# EAGLE design yolo (EAGLE 9.5.0)
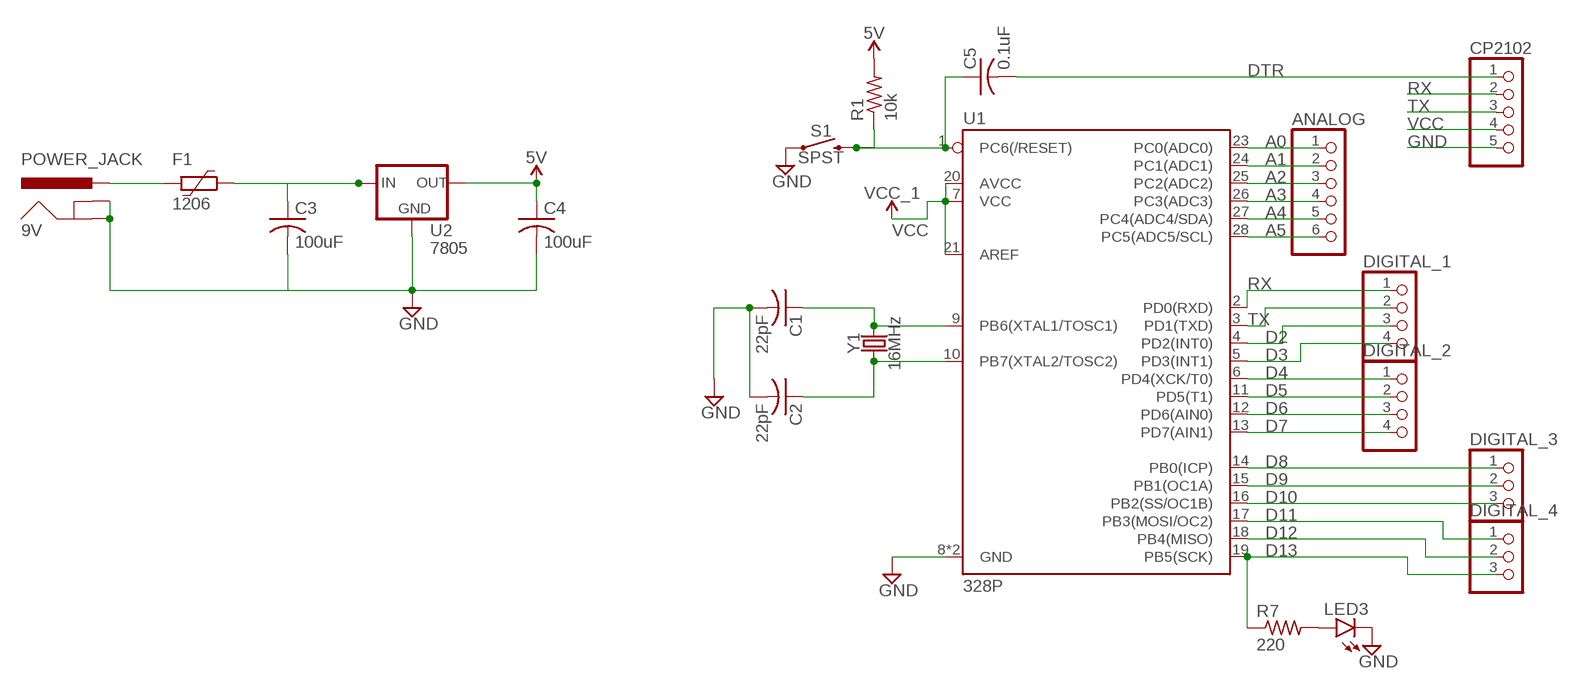
[diagram p0: schematic, sheet 1]

## Parts
9V  POWER_JACK  [POWER_JACK_PTH]
ANALOG  PINHD-1X6  [1X06]
C1  22pF  C-US025-025X050  [C025-025X050]
C2  22pF  C-US025-025X050  [C025-025X050]
C3  100uF  C-US025-025X050  [C025-025X050]
C4  100uF  C-US025-025X050  [C025-025X050]
C5  0.1uF  C-US025-025X050  [C025-025X050]
CP2102  PINHD-1X5  [1X05]
DIGITAL_1  PINHD-1X4  [1X04]
DIGITAL_2  PINHD-1X4  [1X04]
DIGITAL_3  PINHD-1X3  [1X03]
DIGITAL_4  PINHD-1X3  [1X03]
F1  1206  1206L175SL  [1206L]
LED3  LED5MM  [LED5MM]
R1  10k  R-US_0204/7  [0204/7]
R7  220  R-US_0204/7  [0204/7]
S1  SPST  MOMENTARY-SWITCH-SPST-PTH-6.0MM  [TACTILE_SWITCH_PTH_6.0MM]
U1  328P  ATMEGA328P_PDIP  [DIP28]
U2  7805  R-78E5.0-1.0  [DC-DC_CONVERTER_78XX]
Y1  16MHz  CRYSTAL-16MHZPTH-HC49US  [HC49US]

## Nets
A0: ANALOG.1 U1.23(PC0(ADC0))
A1: ANALOG.2 U1.24(PC1(ADC1))
A2: ANALOG.3 U1.25(PC2(ADC2))
A3: ANALOG.4 U1.26(PC3(ADC3))
A4: ANALOG.5 U1.27(PC4(ADC4/SDA))
A5: ANALOG.6 U1.28(PC5(ADC5/SCL))
D2: DIGITAL_1.3 U1.4(PD2(INT0))
D3: DIGITAL_1.4 U1.5(PD3(INT1))
D4: DIGITAL_2.1 U1.6(PD4(XCK/T0))
D5: DIGITAL_2.2 U1.11(PD5(T1))
D6: DIGITAL_2.3 U1.12(PD6(AIN0))
D7: DIGITAL_2.4 U1.13(PD7(AIN1))
D8: DIGITAL_3.1 U1.14(PB0(ICP))
D9: DIGITAL_3.2 U1.15(PB1(OC1A))
D10: DIGITAL_3.3 U1.16(PB2(SS/OC1B))
D11: DIGITAL_4.1 U1.17(PB3(MOSI/OC2))
D12: DIGITAL_4.2 U1.18(PB4(MISO))
D13: DIGITAL_4.3 R7.1 U1.19(PB5(SCK))
DTR: C5.2 CP2102.1
GND: 9V.GND 9V.GNDBREAK C1.2 C2.2 C3.2 C4.2 CP2102.5 LED3.K(C) S1.1 U1.8(GND) U1.22(GND) U2.GND
N$2: 9V.PWR F1.2
N$3: C3.1 F1.1 U2.VIN(IN)
N$4: C1.1 U1.9(PB6(XTAL1/TOSC1)) Y1.2
N$6: C2.1 U1.10(PB7(XTAL2/TOSC2)) Y1.1
N$8: LED3.A R7.2
RST: C5.1 R1.1 S1.3 U1.1(PC6(/RESET))
RX: CP2102.2 DIGITAL_1.1 U1.2(PD0(RXD))
TX: CP2102.3 DIGITAL_1.2 U1.3(PD1(TXD))
VCC: CP2102.4 U1.7(VCC) U1.20(AVCC) U1.21(AREF) ; supply symbol labelled VCC_1
VCC_1: C4.1 R1.2 U2.VOUT(OUT) ; supply symbol labelled 5V

## Library data of the parts
9V = SparkFun-Connectors:POWER_JACK: Power Jack Connector This is the standard 5.5mm barrel jack for power. The PTH is the most common, proven, reliable, footprint. The Slot footprint only works if the mill layer is transmitted to the PCB fab house so be warned. Here are the connectors we sell at SparkFun: DC Barrel Power Jack/Connector <https://www.sparkfun.com/products/119> (PRT-00119) DC Barrel Power Jack/Connector (SMD) <https://www.sparkfun.com/products/12748> (PRT-12748) DC Barrel Jack Adapter - Breadboard Compatible <https://www.sparkfun.com/products/10811> (PRT-10811) It is used on this SparkFun product (and many, many others): SparkFun RedBoard - Programmed with Arduino <https://www.sparkfun.com/products/12757> (DEV-12757) Also, if you need a mating power supply or connector, please check these out: Wall Adapter Power Supply - 9VDC 650mA <https://www.sparkfun.com/products/298> (TOL-00298) DC Barrel Jack Adapter - Male <https://www.sparkfun.com/products/10287> (PRT-10287); PROD_ID: CONN-08197
ANALOG = pinhead:PINHD-1X6: PIN HEADER
C1-C5 = rcl:C-US: CAPACITOR, American symbol; SPICEPREFIX: C
CP2102 = pinhead:PINHD-1X5: PIN HEADER
DIGITAL_1 DIGITAL_2 = pinhead:PINHD-1X4: PIN HEADER
DIGITAL_3 DIGITAL_4 = pinhead:PINHD-1X3: PIN HEADER
F1 = polyfuse-smd_10:?: Polyfuse Resettable PTC Source: http://www.littelfuse.com/products/resettable-ptcs.aspx; MF: Littelfuse; MPN: 1206L175SL; OC_FARNELL: unknown; OC_NEWARK: 69W6447
LED3 = led:LED: LED OSRAM: - CHIPLED LG R971, LG N971, LY N971, LG Q971, LY Q971, LO R971, LY R971 LH N974, LH R974 LS Q976, LO Q976, LY Q976 LO Q996 - Hyper CHIPLED LW Q18S LB Q993, LB Q99A, LB R99A - SideLED LS A670, LO A670, LY A670, LG A670, LP A670 LB A673, LV A673, LT A673, LW A673 LH A674 LY A675 LS A676, LA A676, LO A676, LY A676, LW A676 LS A679, LY A679, LG A679 - Hyper Micro SIDELED® LS Y876, LA Y876, LO Y876, LY Y876 LT Y87S - SmartLED LW L88C, LW L88S LB L89C, LB L89S, LG L890 LS L89K, LO L89K, LY L89K LS L896, LA L896, LO L896, LY L896 - TOPLED LS T670, LO T670, LY T670, LG T670, LP T670 LSG T670, LSP T670, LSY T670, LOP T670, LYG T670 LG T671, LOG T671, LSG T671 LB T673, LV T673, LT T673, LW T673 LH T674 LS T676, LA T676, LO T676, LY T676, LB T676, LH T676, LSB T676, LW T676 LB T67C, LV T67C, LT T67C, LS T67K, LO T67K, LY T67K, LW E67C LS E67B, LA E67B, LO E67B, LY E67B, LB E67C, LV E67C, LT E67C LW T67C LS T679, LY T679, LG T679 LS T770, LO T770, LY T770, LG T770, LP T770 LB T773, LV T773, LT T773, LW T773 LH T774 LS E675, LA E675, LY E675, LS T675 LS T776, LA T776, LO T776, LY T776, LB T776 LHGB T686 LT T68C, LB T68C - Hyper Mini TOPLED® LB M676 - Mini TOPLED Santana® LG M470 LS M47K, LO M47K, LY M47K Source: http://www.osram.convergy.de LUXEON: - LUMILED® LXK2-PW12-R00, LXK2-PW12-S00, LXK2-PW14-U00, LXK2-PW14-V00 LXK2-PM12-R00, LXK2-PM12-S00, LXK2-PM14-U00 LXK2-PE12-Q00, LXK2-PE12-R00, LXK2-PE12-S00, LXK2-PE14-T00, LXK2-PE14-U00 LXK2-PB12-K00, LXK2-PB12-L00, LXK2-PB12-M00, LXK2-PB14-N00, LXK2-PB14-P00, LXK2-PB14-Q00 LXK2-PR12-L00, LXK2-PR12-M00, LXK2-PR14-Q00, LXK2-PR14-R00 LXK2-PD12-Q00, LXK2-PD12-R00, LXK2-PD12-S00 LXK2-PH12-R00, LXK2-PH12-S00 LXK2-PL12-P00, LXK2-PL12-Q00, LXK2-PL12-R00 Source: www.luxeon.com KINGBRIGHT: KA-3528ASYC Source: www.kingbright.com
R1 R7 = rcl:R-US_: RESISTOR, American symbol; SPICEPREFIX: R
S1 = SparkFun-Switches:MOMENTARY-SWITCH-SPST: Momentary Switch (Pushbutton) - SPST Normally-open (NO) SPST momentary switches (buttons, pushbuttons). Variants PTH-12MM - 12mm square, through-hole Momentary Pushbutton Switch - 12mm Square <https://www.sparkfun.com/products/9190> (COM-09190) PTH-6.0MM, PTH-6.0MM-KIT - 6.0mm square, through-hole Mini Pushbutton Switch <https://www.sparkfun.com/products/97> (COM-00097) KIT package intended for soldering kit's - only one side of pads' copper is exposed. PTH-RIGHT-ANGLE-KIT - Right-angle, through-hole Right Angle Tactile Button <https://www.sparkfun.com/products/10791> - Used on SparkFun BigTime Watch Kit <https://www.sparkfun.com/products/11734> SMD-12MM - 12mm square, surface-mount Tactile Button - SMD (12mm) <https://www.sparkfun.com/products/12993> (COM-12993) Used on SparkFun PicoBoard <https://www.sparkfun.com/products/11888> SMD-4.5MM - 4.5mm Square Trackball Switch Used on SparkFun Blackberry Trackballer Breakout <https://www.sparkfun.com/products/13169> SMD-4.6MMX2.8MM - 4.60mm x 2.80mm, surface mount Used on SparkFun SAMD21 Mini Breakout <https://www.sparkfun.com/products/13664> SMD-5.2MM, SMD-5.2-REDUNDANT - 5.2mm square, surface-mount Mini Pushbutton Switch - SMD <https://www.sparkfun.com/products/8720> (COM-08720) Used on Arduino Pro Mini <https://www.sparkfun.com/products/11114> REDUNDANT package connects both switch circuits together SMD-6.0X3.5MM - 6.0 x 3.5mm, surface mount Momentary Reset Switch SMD <https://www.sparkfun.com/products/8229> (COM-08229) SMD-6.2MM-TALL - 6.2mm square, surface mount Tactile Button - SMD (6mm) <https://www.sparkfun.com/products/12992> Used on SparkFun Digital Sandbox <https://www.sparkfun.com/products/12651> SMD-RIGHT-ANGLE - Right-angle, surface mount Used on SparkFun Block for Intel® Edison - Arduino <https://www.sparkfun.com/products/13036>; PROD_ID: SWCH-08441; SF_SKU: COM-00097
U1 = SparkFun-IC-Microcontroller:ATMEGA328P_PDIP: Atmel 328P Through hole ATMEGA328P uC used in the Arduino 32kb flash, 1k EEPROM, 2k SRAM Datasheet <http://www.sparkfun.com/datasheets/Components/SMD/ATMega328.pdf> SparkFun Products Storefront component: AVR 28 Pin 20MHz 32K 6A/D - ATMega328P <https://www.sparkfun.com/products/9061> (COM-09061) SparkFun Simon Says - Through-Hole Soldering Kit <https://www.sparkfun.com/products/10547> (KIT-10547) SparkFun Learn to Solder - Simon Says <https://www.sparkfun.com/products/13708> (KIT-13708) SparkFun BigTime Watch Kit <https://www.sparkfun.com/products/11734> (KIT-11734) SparkFun ClockIt <https://www.sparkfun.com/products/10930> (KIT-10930) SparkFun Serial Enabled LCD Kit <https://www.sparkfun.com/products/10097> (LCD-10097) SparkFun Simon Tilts - Through Hole Soldering Kit <https://www.sparkfun.com/products/12634> (KIT-12634) SparkFun Frequency Counter Kit <https://www.sparkfun.com/products/10140> (KIT-10140) FabFM Radio Kit <https://www.sparkfun.com/products/11043> (KIT-11043) SparkFun Binary Blaster Kit <https://www.sparkfun.com/products/12037> (KIT-12037) SparkFun Metro-Gnome <https://www.sparkfun.com/products/9236> (KIT-09236) ATmega328 with Arduino Optiboot (Uno) <https://www.sparkfun.com/products/10524> (DEV-10524); PROD_ID: IC-09136
U2 = SparkFun-IC-Power:R-78E5.0-1.0: Recom Power 5V 1A DC/DC Converter The Recom R-78E5.0-X.X is a compact DC/DC converter module that is a pin for pin drop-in replacement for the LM7805 linear voltage regulator. Specifications: Input Range: 7-28V Output Voltage: 5V Output Current: 1A Max Efficiency: 91% Datasheet <https://www.recom-power.com/pdf/Innoline/R-78Exx-1.0.pdf>; PROD_ID: COM-13655
Y1 = SparkFun-Clocks:CRYSTAL-16MHZ: 16MHz Crystal Digikey Example <http://www.digikey.com/product-search/en?keywords=535-9122-1-ND> Frequency: 16MHz Frequency Stability: ±50ppm Frequency Tolerance: ±20ppm Load Capacitance: 18pF SparkFun Products: Pro Micro -5V/16MHz <https://www.sparkfun.com/products/12640> SparkFun Serial Enabled LCD Kit <https://www.sparkfun.com/products/10097>; PROD_ID: XTAL-08181; SF_ID: COM-00536

## Board
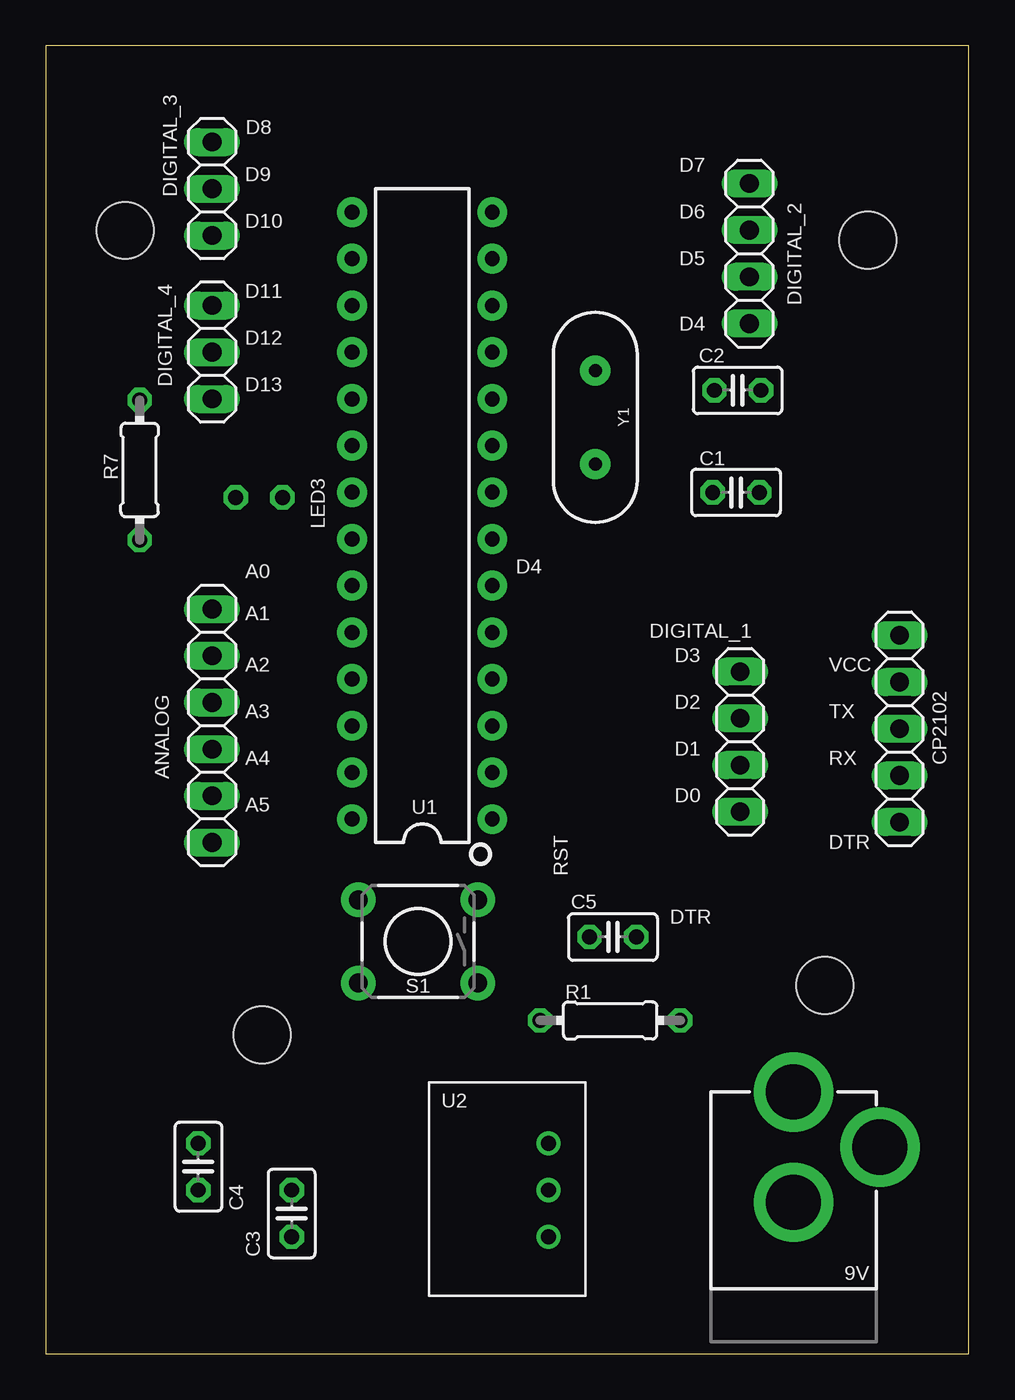
[diagram p1: board, top side]
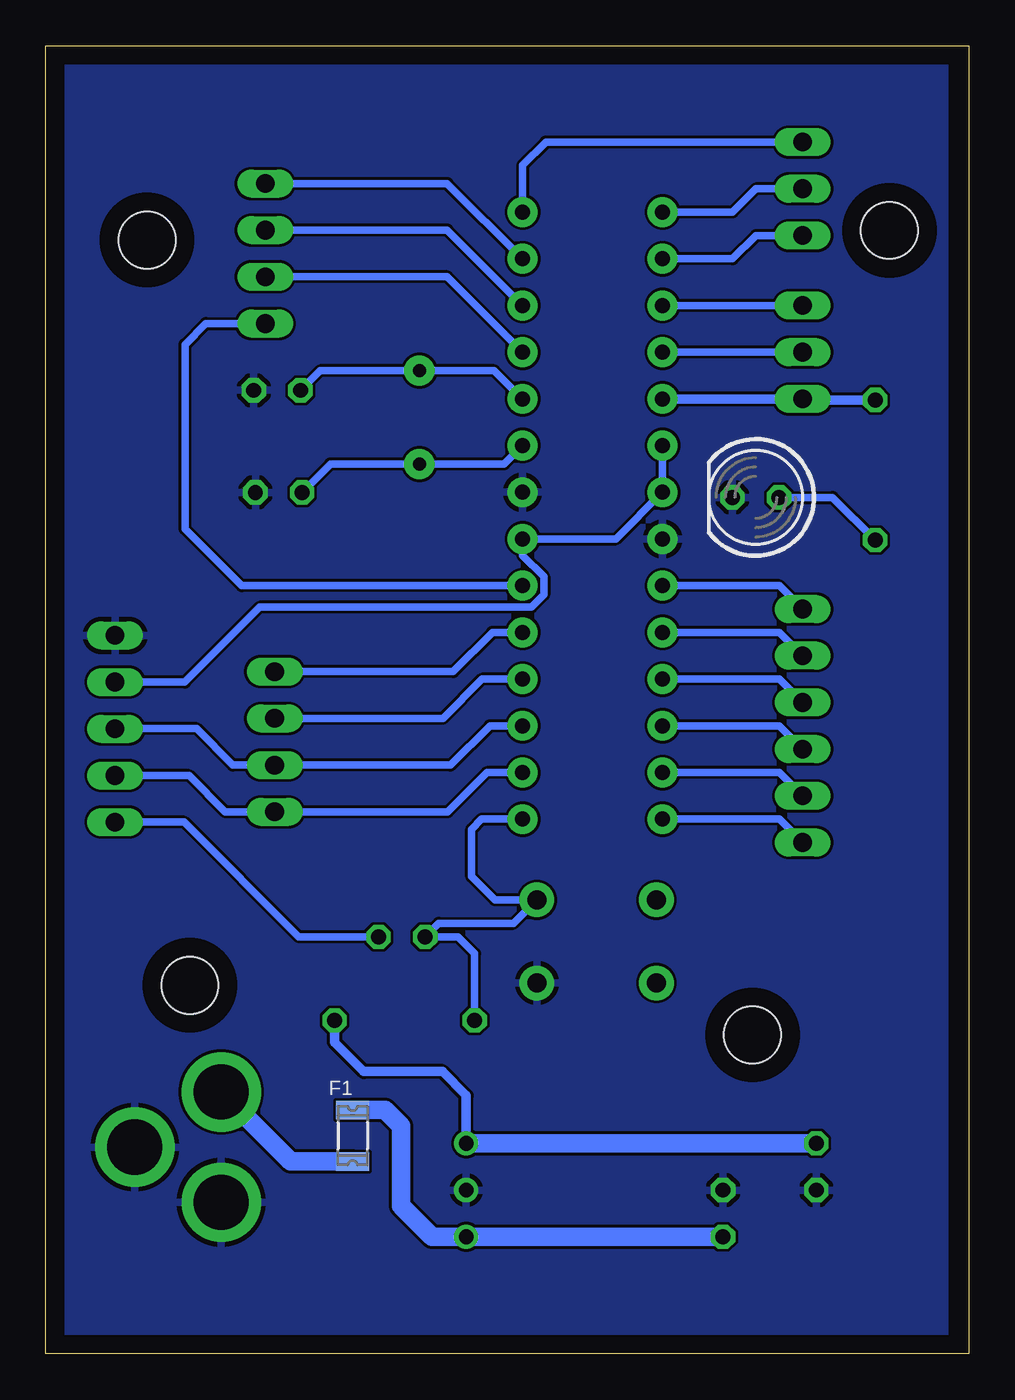
[diagram p2: board, bottom side, seen from below]

Size 50.2 x 71.12 mm. Coordinates in mm from the lower left corner, seen from the top.
Outline: 0,0 50.2,0 50.2,71.12 0,71.12 0,0
Copper layers (1*16): Top 0.035mm / dielectric 1.5mm / Bottom 0.035mm
Design rules "default": minimum track width 6mil, minimum drill 0.35mm, track to track 6mil, track to pad 6mil, pad to pad 6mil, via to via 6mil, smd to smd 6mil, copper to edge 40mil, drill to drill 6mil, minimum pad ring 10mil, minimum via ring 8mil, stop-mask expansion 4mil, vias tented up to drill 0mil, thermal gap 10mil
Holes 3.1 mm at 42.37,20.03 44.7,60.57 4.31,61.09 11.77,17.33

### Footprints (pad centres in the part's own frame; a part is rotated, then mirrored left to right if it is on the bottom)
POWER_JACK_PTH = drill 2.997 pad 4.318: GND 0,7.7; GNDBREAK 4.7,10.7; PWR 0,13.7
1X06 = drill 1.016 long: 1 -6.35,0; 2 -3.81,0; 3 -1.27,0; 4 1.27,0; 5 3.81,0; 6 6.35,0
C025-025X050 = drill 0.813 octagon: 1 -1.27,0; 2 1.27,0
1X05 = drill 1.016 long: 1 -5.08,0; 2 -2.54,0; 3 0,0; 4 2.54,0; 5 5.08,0
1X04 = drill 1.016 long: 1 -3.81,0; 2 -1.27,0; 3 1.27,0; 4 3.81,0
1X03 = drill 1.016 long: 1 -2.54,0; 2 0,0; 3 2.54,0
1206L = smd 1 x 1.8: 1 -1.4,0; 2 1.4,0
LED5MM = drill 0.813 octagon: A -1.27,0; K 1.27,0
0204/7 = drill 0.813 octagon: 1 -3.81,0; 2 3.81,0
TACTILE_SWITCH_PTH_6.0MM = drill 1.016 pad 1.88: 1 -3.251,2.261; 2 3.251,2.261; 3 -3.251,-2.261; 4 3.251,-2.261
DIP28 = drill 0.813 pad 1.626: 1 -16.51,-3.81; 2 -13.97,-3.81; 3 -11.43,-3.81; 4 -8.89,-3.81; 5 -6.35,-3.81; 6 -3.81,-3.81; 7 -1.27,-3.81; 8 1.27,-3.81; 9 3.81,-3.81; 10 6.35,-3.81; 11 8.89,-3.81; 12 11.43,-3.81; 13 13.97,-3.81; 14 16.51,-3.81; 15 16.51,3.81; 16 13.97,3.81; 17 11.43,3.81; 18 8.89,3.81; 19 6.35,3.81; 20 3.81,3.81; 21 1.27,3.81; 22 -1.27,3.81; 23 -3.81,3.81; 24 -6.35,3.81; 25 -8.89,3.81; 26 -11.43,3.81; 27 -13.97,3.81; 28 -16.51,3.81
DC-DC_CONVERTER_78XX = drill 0.8: GND 0,0; VIN -2.54,0; VOUT 2.54,0
HC49US = drill 0.7 pad 1.651: 1 -2.54,0; 2 2.54,0

### Placement (x,y rotation side)
9V  40.67,0.53 0 top
ANALOG  9.04,34.14 270 top
C1  37.54,46.84 0 top
C2  37.63,52.39 0 top
C3  13.37,7.62 90 top
C4  8.29,10.16 270 top
C5  30.84,22.66 0 top
CP2102  46.44,33.98 90 top
DIGITAL_1  37.76,33.28 90 top
DIGITAL_2  38.27,59.83 90 top
DIGITAL_3  9.04,63.35 270 top
DIGITAL_4  9.04,54.46 270 top
F1  33.52,11.85 270 bottom
LED3  11.59,46.57 180 bottom
R1  30.69,18.12 0 top
R7  5.09,48.06 270 top
S1  20.24,22.42 180 top
U1  20.47,45.57 90 top
U2  27.34,8.89 90 top
Y1  29.88,50.92 270 top

### Tracks (layer width: path | path; a pad name or v marks a point on that pad's centre or on a via)
A0
  Bottom 0.406: ANALOG.1 10.31,41.76 U1.23
A1
  Bottom 0.406: ANALOG.2 10.31,39.22 U1.24
A2
  Bottom 0.406: ANALOG.3 10.31,36.68 U1.25
A3
  Bottom 0.406: ANALOG.4 10.31,34.14 U1.26
A4
  Bottom 0.406: ANALOG.5 10.31,31.6 U1.27
A5
  Bottom 0.406: ANALOG.6 10.31,29.06 U1.28
D2
  Bottom 0.406: U1.4 26.47,36.68 28.61,34.55 DIGITAL_1.3
D3
  Bottom 0.406: U1.5 25.92,39.22 28.05,37.09 DIGITAL_1.4
D4
  Bottom 0.406: U1.6 39.55,41.76 42.64,44.85 42.64,54.89 41.5,56.02 DIGITAL_2.1
D5
  Bottom 0.406: U1.11 28.38,58.56 DIGITAL_2.2
D6
  Bottom 0.406: U1.12 28.38,61.1 DIGITAL_2.3
D7
  Bottom 0.406: U1.13 28.38,63.64 DIGITAL_2.4
D8
  Bottom 0.406: U1.14 24.28,64.62 23.01,65.89 DIGITAL_3.1
D9
  Bottom 0.406: DIGITAL_3.2 11.58,63.35 12.85,62.08 U1.15
D10
  Bottom 0.406: DIGITAL_3.3 11.58,60.81 12.85,59.54 U1.16
D11
  Bottom 0.406: DIGITAL_4.1 U1.17
D12
  Bottom 0.406: DIGITAL_4.2 U1.18
D13
  Bottom 0.508: U1.19 DIGITAL_4.3 8.98,51.87 R7.1
DTR
  Bottom 0.406: C5.2 36.45,22.66 42.69,28.9 CP2102.1
GND
  pour Bottom: 1.3,0 1.3,71.12 50.2,71.12 50.2,0
N$2
  Bottom 1.016: F1.2 36.89,10.45 9V.PWR
N$3
  Bottom 1.016: C3.1 U2.VIN 29.19,6.35 30.88,8.04 30.88,12.38 31.75,13.25 F1.1
N$4
  Bottom 0.406: U1.9 25.28,48.38 Y1.2 34.73,48.38 C1.1
N$6
  Bottom 0.406: U1.10 25.81,53.46 Y1.1 35.28,53.46 C2.1
N$8
  Bottom 0.406: LED3.A 7.41,46.56 R7.2
RST
  Bottom 0.406: U1.1 26.49,29.06 27.04,28.52 27.04,25.94 25.78,24.68 S1.3 24.77,23.4 28.84,23.4 C5.1 27.78,22.66 26.88,21.76 R1.1
RX
  Bottom 0.406: U1.2 26.21,31.6 28.34,29.47 DIGITAL_1.1 40.44,29.47 42.41,31.44 CP2102.2
TX
  Bottom 0.406: U1.3 26.05,34.14 28.19,32.01 DIGITAL_1.2 40.03,32.01 42.02,33.99 CP2102.3
VCC
  Bottom 0.406: U1.20 U1.21 19.2,44.3 U1.7 24.28,43.42 23.11,42.25 23.11,41.28 23.79,40.6 38.58,40.6 42.65,36.52 CP2102.4
VCC_1
  Bottom 0.406: R1.2
  Bottom 0.508: U2.VOUT 27.34,14.04 28.64,15.34 32.91,15.34 34.5,16.93 R1.2
  Bottom 1.016: U2.VOUT C4.1

### Text on the board
tNames: D8 | D9 | D7 | D6 | D10 | D5 | D11 | D4 | D12 | D13 | A0 | D4 | A1 | D3 | A2 | VCC | A3 | D2 | TX | D1 | A4 | RX | D0 | A5 | RST | DTR | DTR